# EasyEDA schematic Project6 Circuit Diagrams_1.1.json

## Sheets
1 Main: TITLE: Chopped Diagram Project 6; REV: 1.2; Date: 2026-03-11; Sheet: 1/1; Company: EELE 465
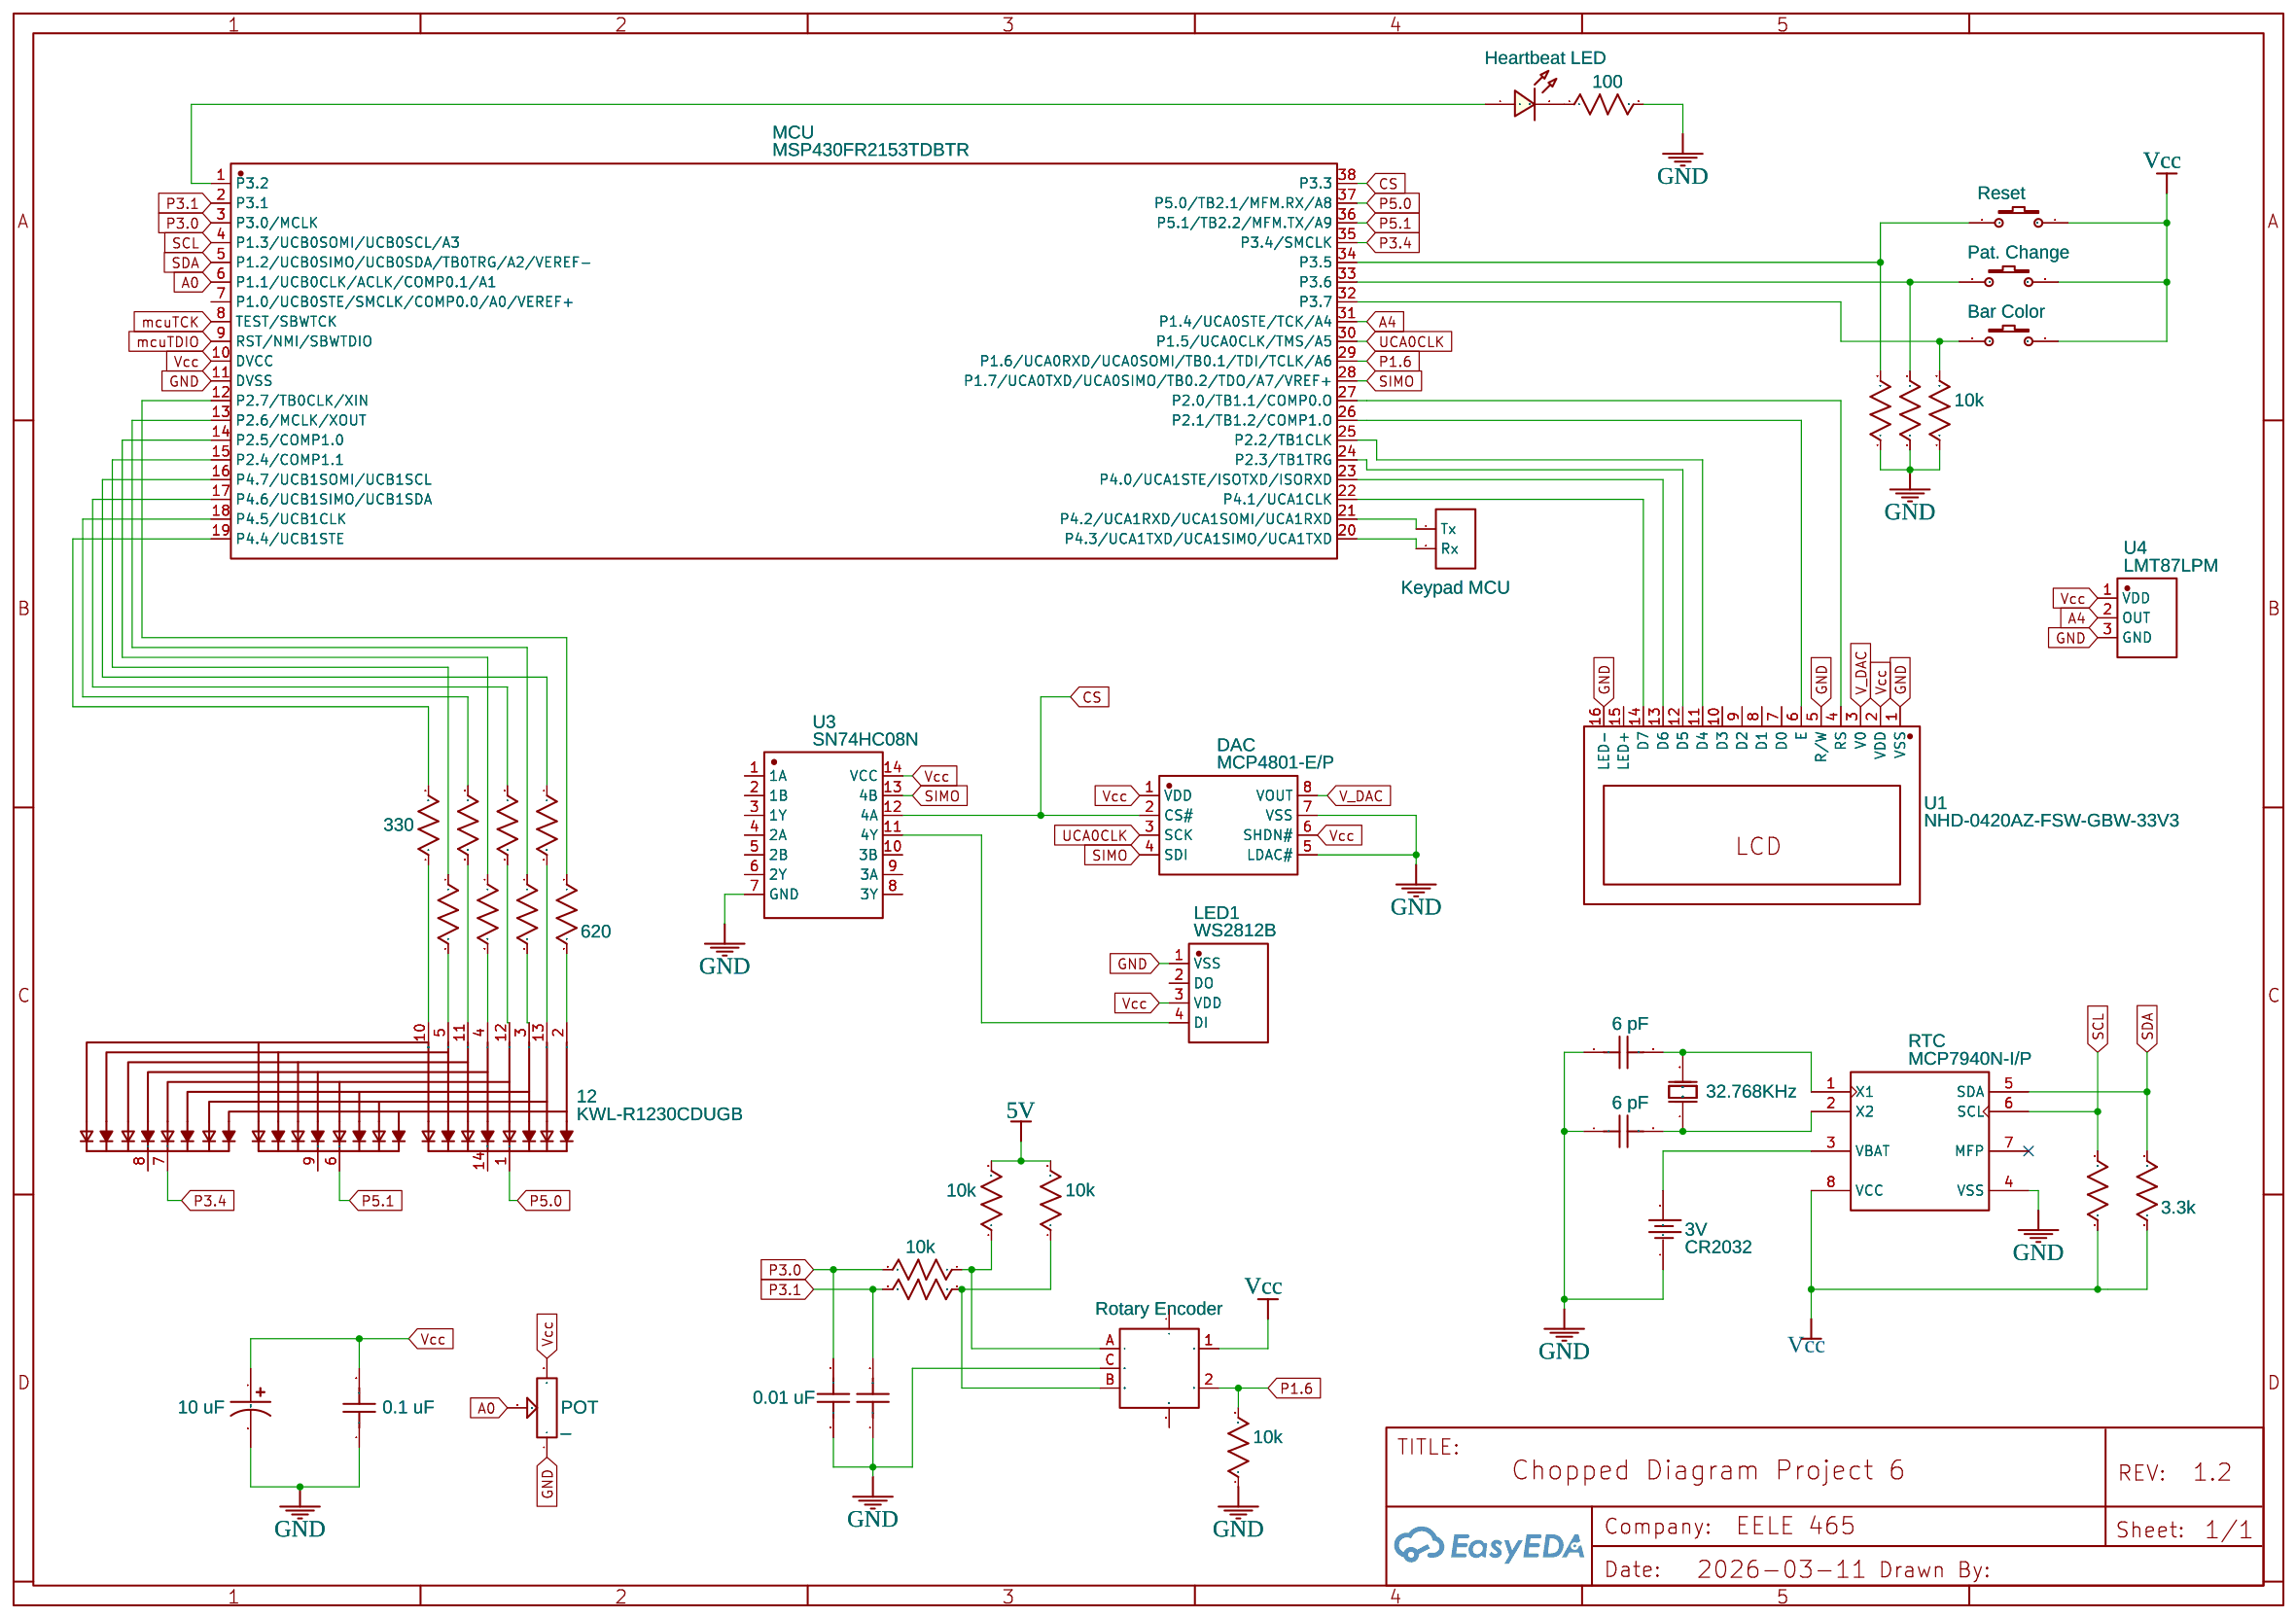
[diagram p0: Main]
2 Keypad: TITLE: Chopped Diagram Project 6 - Keypad; REV: 1.0; Date: 2026-03-24
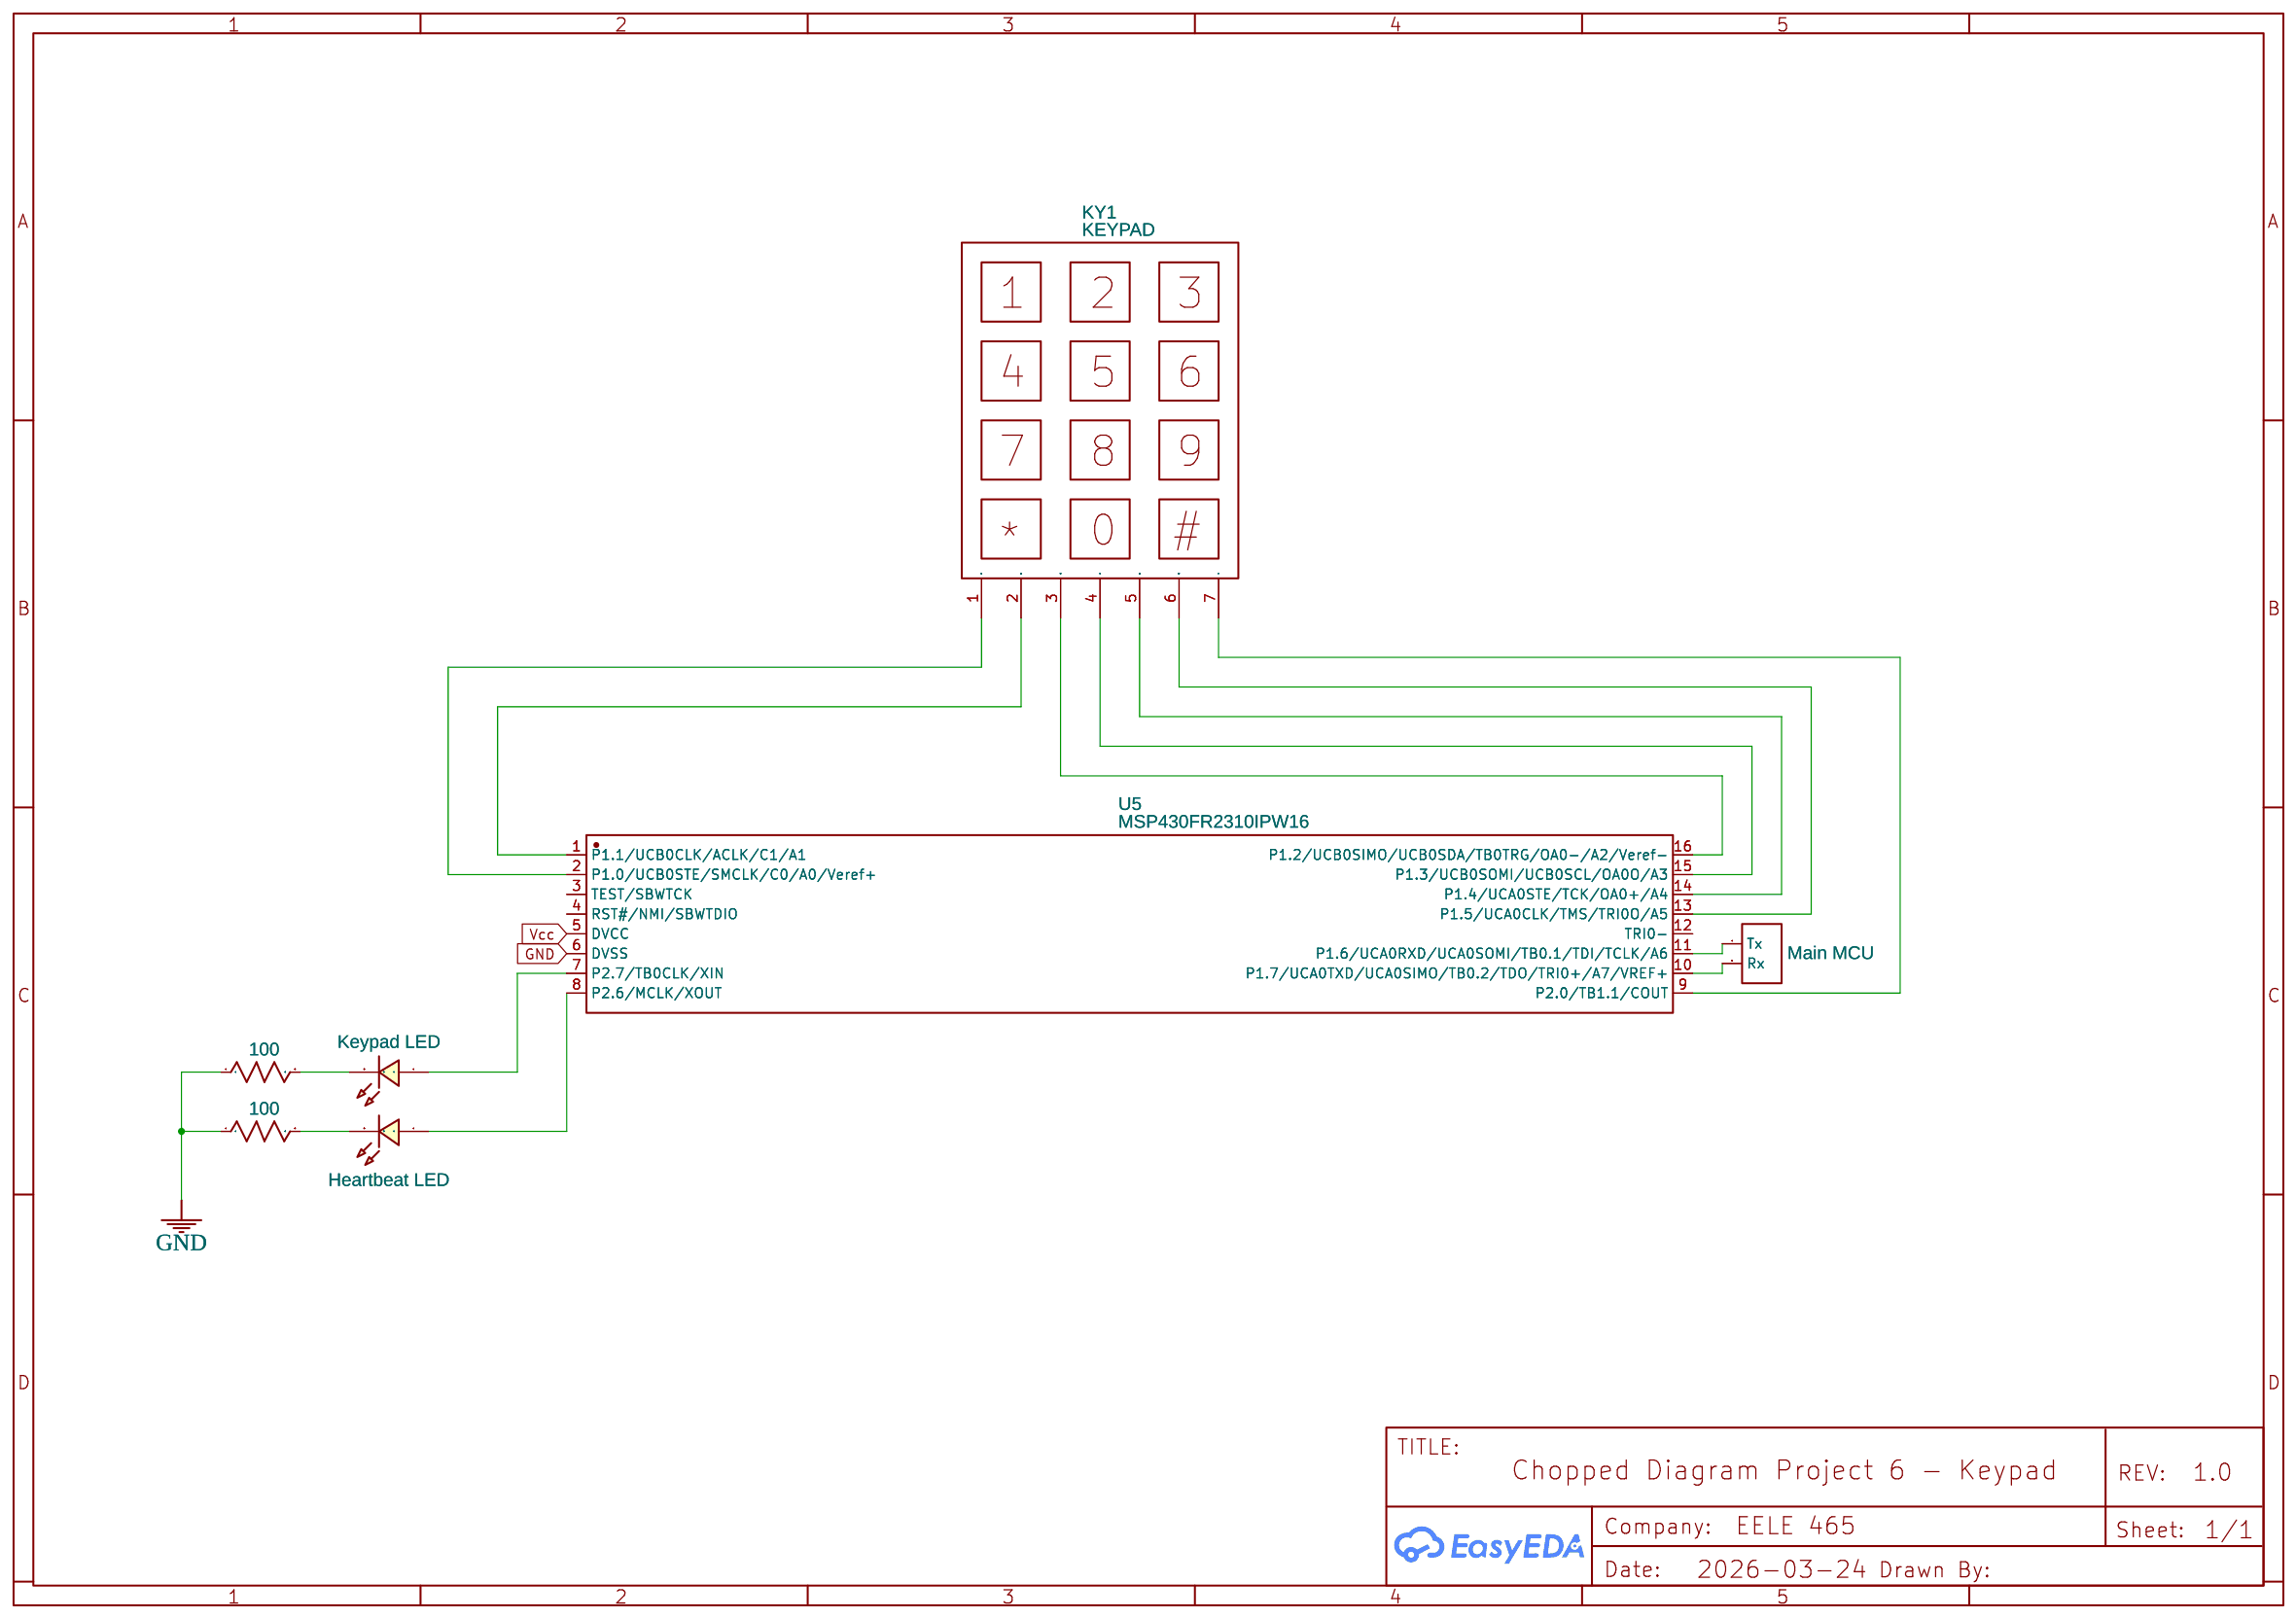
[diagram p1: Keypad]

## Parts
sheet Keypad
CMD-LINE1  Main MCU  [HDR-F-2.54_1X2]
KY1  KEYPAD  [KEYPAD_FP]
R11  100  [R0603]
R12  100  [R0603]
STATUS2  Heartbeat LED  [LED0603_GREEN]
STATUS3  Keypad LED  [LED0603_GREEN]
U5  MSP430FR2310IPW16  [TSSOP-16_L5.0-W4.4-P0.65-LS6.4-BL]
sheet Main
3V  CR2032  [BAT-TH_CH25-2032LF]
12  KWL-R1230CDUGB  [LED-SEG-TH_L30.4-W10.1-P2.54-S7.42-BL]
C1  6 pF  [C0603]
C2  6 pF  [C0603]
C3  10 uF  [CASE-A_3216]
C4  0.1 uF  [C0603]
C5  0.01 uF  [C0603]
C6  0.01 uF  [C0603]
CMD-LINE  Keypad MCU  [HDR-F-2.54_1X2]
DAC  MCP4801-E/P  [PDIP-8_L9.6-W6.4-P2.54-LS7.9-BL]
KEY1  Pat. Change  [KEY-SMD_2P-L6.2-W3.6-LS8.0]
KEY2  Reset  [KEY-SMD_2P-L6.2-W3.6-LS8.0]
KEY3  Bar Color  [KEY-SMD_2P-L6.2-W3.6-LS8.0]
LED1  WS2812B  [LED-SMD_L4.0-W1.7_WS2812B-4020]
MCU  MSP430FR2153TDBTR  [TSSOP-38_L9.7-W4.4-P0.50-LS6.4-TL]
POT  _  [SLIDE-POTENTIOMETER-45MM]
R1  330  [R0603]
R2  1k  [R0603]
R3  1k  [R0603]
R4  1k  [R0603]
R5  1k  [R0603]
R6  1k  [R0603]
R7  100  [R0603]
R8  10k  [R0603]
R9  330  [R0603]
R10  620  [R0603]
R13  10k  [R0603]
R14  10k  [R0603]
R15  10k  [R0603]
R16  10k  [R0603]
R17  10k  [R0603]
R18  1k  [R0603]
R19  3.3k  [R0603]
R20  10k  [R0603]
R21  10k  [R0603]
RTC  MCP7940N-I/P  [DIP-8_L9.8-W6.6-P2.54-LS7.6-BL]
SC1_ENC  Rotary Encoder  [SW-TH_PEC12R-4130F-S0012]
STATUS1  Heartbeat LED  [LED0603_GREEN]
U1  NHD-0420AZ-FSW-GBW-33V3  [LCD-TH_NHD-0420AZ-FSW-GBW-33V3]
U3  SN74HC08N  [DIP-14_L19.2-W6.6-P2.54-LS10.9-BL]
U4  LMT87LPM  [TO-92-3_L4.8-W3.7-P2.60-L]
X1  32.768KHz  [CRYSTAL-TH_BD2.0-L6.0-P1.27]

## Library data of the parts
CMD-LINE CMD-LINE1 = HDR-F-2.54_1x2: Supplier Part: C49661; Supplier: LCSC; Contributor: LCEDA_Lib; Package Display: No
KY1 = KEYPAD: Contributor: aomsin.ma
R1-R21 = R_0603_US: Contributor: LCEDA_Lib
STATUS1-STATUS3 = LED-0603_G: Manufacturer: EVERLIGHT(台湾亿光); Manufacturer Part: 19-217/GHC-YR1S2/3T; Supplier Part: C72043; Supplier: LCSC; Contributor: LCEDA_Lib
U5 = MSP430FR2310IPW16: Contributor: lcsc; Supplier: LCSC; Supplier Part: C1340796; Manufacturer: TI(德州仪器); JLCPCB Part Class: Extended Part
3V = CH25-2032LF: Supplier: LCSC; Supplier Part: C22446975; Manufacturer: Multicomp; JLCPCB Part Class: Extended Part; Contributor: lcsc; Package Display: No
12 = KWL-R1230CDUGB: Supplier: LCSC; Supplier Part: C9900114020; Manufacturer: null; Contributor: lcsc
C1 C2 = C_0603_US: Contributor: LCEDA_Lib; Package Display: No
C3 = C_Tan_SMD_A_US: Contributor: LCEDA_Lib
C4-C6 = C_0603_US: Contributor: LCEDA_Lib
DAC = MCP4801-E/P: Contributor: lcsc; Supplier: LCSC; Supplier Part: C640385; Manufacturer: MICROCHIP(美国微芯); JLCPCB Part Class: Extended Part
KEY1-KEY3 = K2-3.6×6.1_SMD: Supplier Part: C118141; Supplier: LCSC; Manufacturer Part: K2-1107ST-A4SW-06; Contributor: LCEDA_Lib; 制造商: 韩国韩荣
LED1 = WS2812B-4020SIDE-WGYH: Supplier: LCSC; Supplier Part: C9900147583; Manufacturer: null; Manufacturer Part: WS2812B-4020side-WGYH; Contributor: lcsc
MCU = MSP430FR2153TDBTR: Contributor: lcsc; Supplier: LCSC; Supplier Part: C2054995; Manufacturer: TI(德州仪器); JLCPCB Part Class: Extended Part
POT = SLIDE_POTENTIOMETER_45: Contributor: PavelZverina
RTC = MCP7940N-I/P: Contributor: LCSC; Supplier: LCSC; Manufacturer: MICROCHIP(美国微芯); Supplier Part: C153264; JLCPCB Part Class: Extended Part; Package Display: No
SC1_ENC = PEC12R-4130F-S0012: Supplier: LCSC; Supplier Part: C143795; Manufacturer: BOURNS; Contributor: Павел Майоров; JLCPCB Part Class: Extended Part
U1 = NHD-0420AZ-FSW-GBW-33V3: Supplier: LCSC; Supplier Part: C17569191; Manufacturer: Newhaven display; JLCPCB Part Class: Extended Part; Contributor: lcsc
U3 = SN74HC08N: Supplier: LCSC; Manufacturer: TI(德州仪器); Supplier Part: C2887; JLCPCB Part Class: Extended Part
U4 = LMT87LPM: Supplier: LCSC; Supplier Part: C2861759; Manufacturer: TI(德州仪器); JLCPCB Part Class: Extended Part; Contributor: lcsc
X1 = CFS-20632768EZFB: Contributor: LCSC; Supplier: LCSC; Supplier Part: C326534; Manufacturer: null; Manufacturer Part: CFS-20632768EZF; JLCPCB Part Class: Extended Part

## Nets
5V: R16.2 R17.2
GND: 3V.1 C1.1 C2.1 C3.2 C4.1 C5.1 C6.1 DAC.5(LDAC#) DAC.7(VSS) LED1.1(VSS) MCU.11(DVSS) POT.A R7.2 R8.1 R11.1 R12.1 R13.1 R14.1 R15.1 RTC.4(VSS) SC1_ENC.C U1.1(VSS) U1.5(R/W) U1.16(LED-) U3.7(GND) U4.3(GND) U5.6(DVSS)
Vcc: C3.1 C4.2 DAC.1(VDD) DAC.6(SHDN#) KEY1.2 KEY2.2 KEY3.2 LED1.3(VDD) MCU.10(DVCC) POT.D(C) R18.1 R19.1 RTC.8(VCC) SC1_ENC.1 U1.2(VDD) U3.14(VCC) U4.1(VDD) U5.5(DVCC)
A0: MCU.6(P1.1/UCB0CLK/ACLK/COMP0.1/A1) POT.B
A4: MCU.31(P1.4/UCA0STE/TCK/A4) U4.2(OUT)
CS: DAC.2(CS#) MCU.38(P3.3) U3.12(4A)
mcuTCK: MCU.8(TEST/SBWTCK)
mcuTDIO: MCU.9(RST/NMI/SBWTDIO)
P1.6: MCU.29(P1.6/UCA0RXD/UCA0SOMI/TB0.1/TDI/TCLK/A6) R15.2 SC1_ENC.2
P3.0: C5.2 MCU.3(P3.0/MCLK) R20.2
P3.1: C6.2 MCU.2(P3.1) R21.2
P3.4: 12.7 MCU.35(P3.4/SMCLK)
P5.0: 12.1 MCU.37(P5.0/TB2.1/MFM.RX/A8)
P5.1: 12.6 MCU.36(P5.1/TB2.2/MFM.TX/A9)
SCL: MCU.4(P1.3/UCB0SOMI/UCB0SCL/A3) R18.2 RTC.6(SCL)
SDA: MCU.5(P1.2/UCB0SIMO/UCB0SDA/TB0TRG/A2/VEREF-) R19.2 RTC.5(SDA)
SIMO: DAC.4(SDI) MCU.28(P1.7/UCA0TXD/UCA0SIMO/TB0.2/TDO/A7/VREF+) U3.13(4B)
UCA0CLK: DAC.3(SCK) MCU.30(P1.5/UCA0CLK/TMS/A5)
V_DAC: DAC.8(VOUT) U1.3(V0)
Net-(3V-2): 3V.2 RTC.3(VBAT)
Net-(12-2): 12.2 R10.2
Net-(12-3): 12.3 R6.2
Net-(12-4): 12.4 R4.2
Net-(12-5): 12.5 R2.2
Net-(12-10): 12.10 R1.1
Net-(12-11): 12.11 R3.2
Net-(12-12): 12.12 R5.2
Net-(12-13): 12.13 R9.2
Net-(C1-2): C1.2 RTC.1(X1) X1.2(OSC2)
Net-(C2-2): C2.2 RTC.2(X2) X1.1(OSC1)
Net-(CMD-LINE1-1): CMD-LINE1.1(Tx) U5.11(P1.6/UCA0RXD/UCA0SOMI/TB0.1/TDI/TCLK/A6)
Net-(CMD-LINE1-2): CMD-LINE1.2(Rx) U5.10(P1.7/UCA0TXD/UCA0SIMO/TB0.2/TDO/TRI0+/A7/VREF+)
Net-(CMD-LINE-1): CMD-LINE.1(Tx) MCU.21(P4.2/UCA1RXD/UCA1SOMI/UCA1RXD)
Net-(CMD-LINE-2): CMD-LINE.2(Rx) MCU.20(P4.3/UCA1TXD/UCA1SIMO/UCA1TXD)
Net-(KEY1-1): KEY1.1 MCU.33(P3.6) R13.2
Net-(KEY2-1): KEY2.1 MCU.34(P3.5) R14.2
Net-(KEY3-1): KEY3.1 MCU.32(P3.7) R8.2
Net-(KY1-1): KY1.1 U5.2(P1.0/UCB0STE/SMCLK/C0/A0/Veref+)
Net-(KY1-2): KY1.2 U5.1(P1.1/UCB0CLK/ACLK/C1/A1)
Net-(KY1-3): KY1.3 U5.16(P1.2/UCB0SIMO/UCB0SDA/TB0TRG/OA0-/A2/Veref-)
Net-(KY1-4): KY1.4 U5.15(P1.3/UCB0SOMI/UCB0SCL/OA0O/A3)
Net-(KY1-5): KY1.5 U5.14(P1.4/UCA0STE/TCK/OA0+/A4)
Net-(KY1-6): KY1.6 U5.13(P1.5/UCA0CLK/TMS/TRI0O/A5)
Net-(KY1-7): KY1.7 U5.9(P2.0/TB1.1/COUT)
Net-(LED1-4): LED1.4(DI) U3.11(4Y)
Net-(MCU-1): MCU.1(P3.2) STATUS1.1
Net-(MCU-12): MCU.12(P2.7/TB0CLK/XIN) R10.1
Net-(MCU-13): MCU.13(P2.6/MCLK/XOUT) R6.1
Net-(MCU-14): MCU.14(P2.5/COMP1.0) R4.1
Net-(MCU-15): MCU.15(P2.4/COMP1.1) R2.1
Net-(MCU-16): MCU.16(P4.7/UCB1SOMI/UCB1SCL) R9.1
Net-(MCU-17): MCU.17(P4.6/UCB1SIMO/UCB1SDA) R5.1
Net-(MCU-18): MCU.18(P4.5/UCB1CLK) R3.1
Net-(MCU-19): MCU.19(P4.4/UCB1STE) R1.2
Net-(MCU-22): MCU.22(P4.1/UCA1CLK) U1.14(D7)
Net-(MCU-23): MCU.23(P4.0/UCA1STE/ISOTXD/ISORXD) U1.13(D6)
Net-(MCU-24): MCU.24(P2.3/TB1TRG) U1.12(D5)
Net-(MCU-25): MCU.25(P2.2/TB1CLK) U1.11(D4)
Net-(MCU-26): MCU.26(P2.1/TB1.2/COMP1.O) U1.6(E)
Net-(MCU-27): MCU.27(P2.0/TB1.1/COMP0.O) U1.4(RS)
Net-(R7-1): R7.1 STATUS1.2
Net-(R11-2): R11.2 STATUS3.2
Net-(R12-2): R12.2 STATUS2.2
Net-(R16-1): R16.1 R20.1 SC1_ENC.A
Net-(R17-1): R17.1 R21.1 SC1_ENC.B
Net-(STATUS2-1): STATUS2.1 U5.8(P2.6/MCLK/XOUT)
Net-(STATUS3-1): STATUS3.1 U5.7(P2.7/TB0CLK/XIN)

Not connected (* = marked no-connect by the designer): 12 8 9 14; LED1 2(DO); MCU 7(P1.0/UCB0STE/SMCLK/COMP0.0/A0/VEREF+); RTC 7(MFP)*; SC1_ENC 3 4; U1 7(D0) 8(D1) 9(D2) 10(D3) 15(LED+); U3 1(1A) 2(1B) 3(1Y) 4(2A) 5(2B) 6(2Y) 8(3Y) 9(3A) 10(3B); U5 3(TEST/SBWTCK) 4(RST#/NMI/SBWTDIO) 12(TRI0-)
